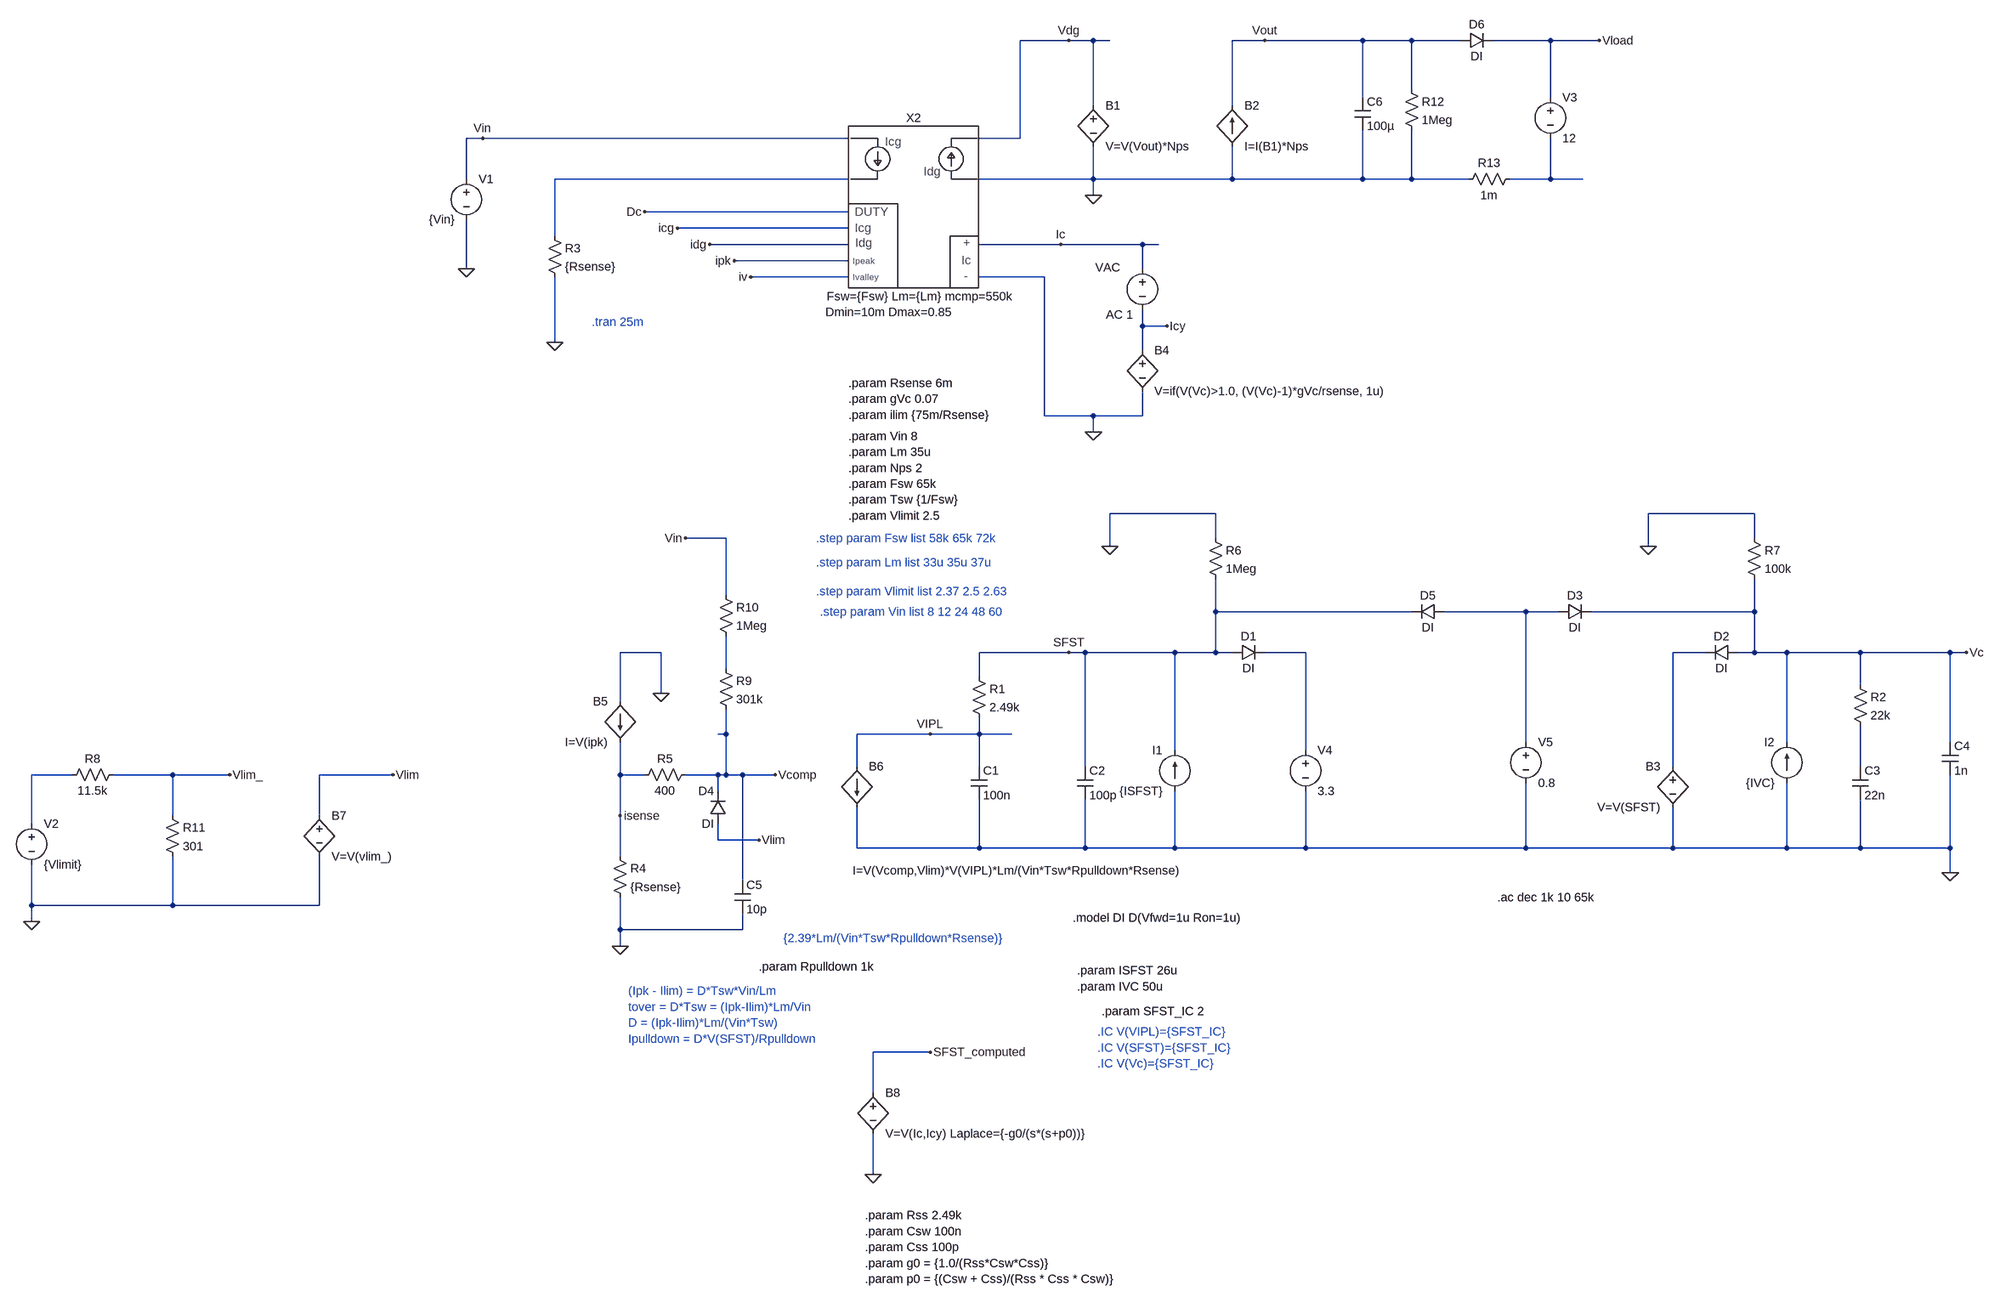
[diagram p0: schematic Intake_Power_Limiter_AC_Loop_Gain.asc]
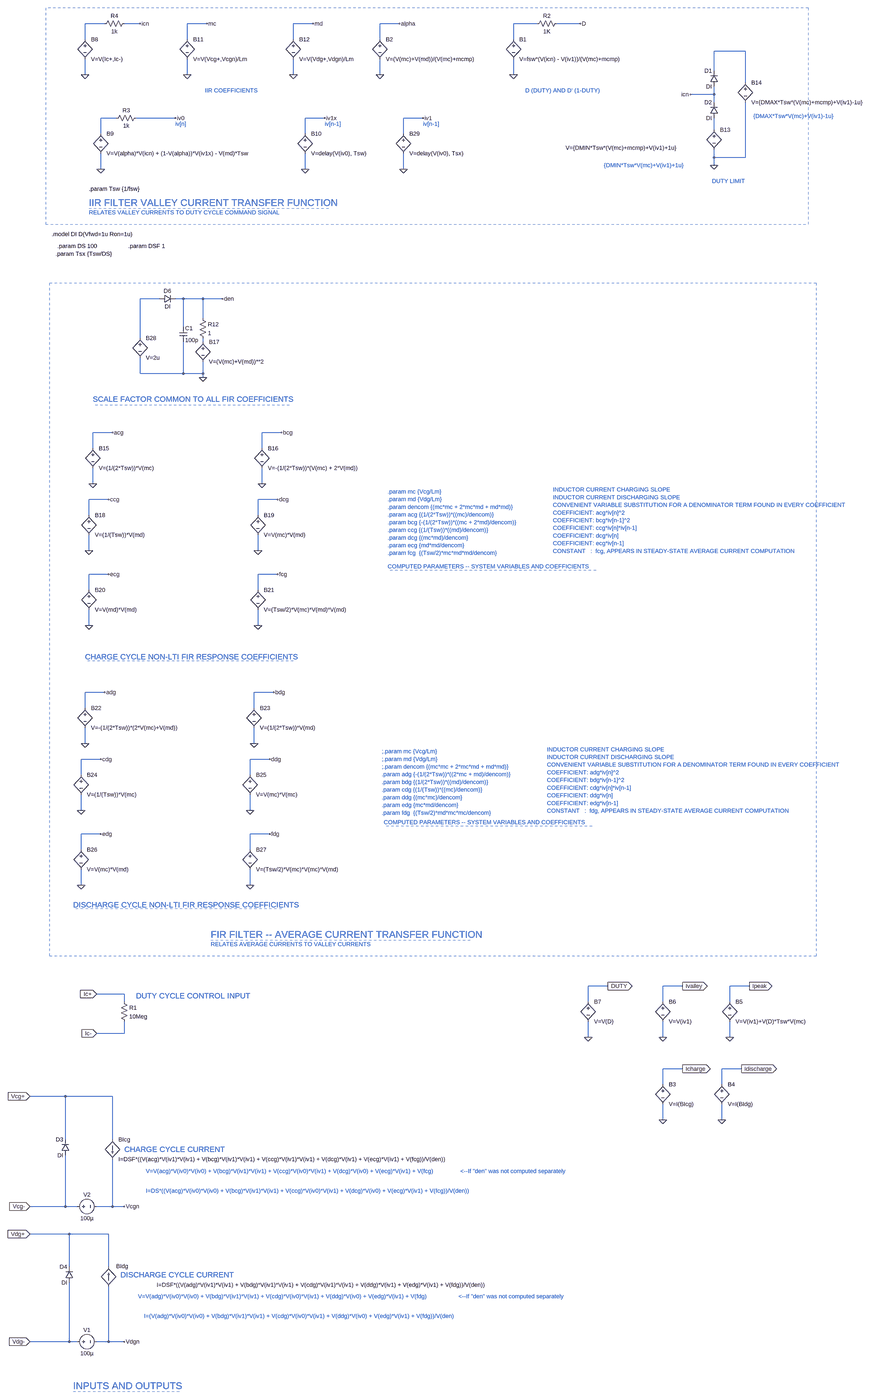
[diagram p1: sub-circuit cpm_control_irm.asc, whole sheet]
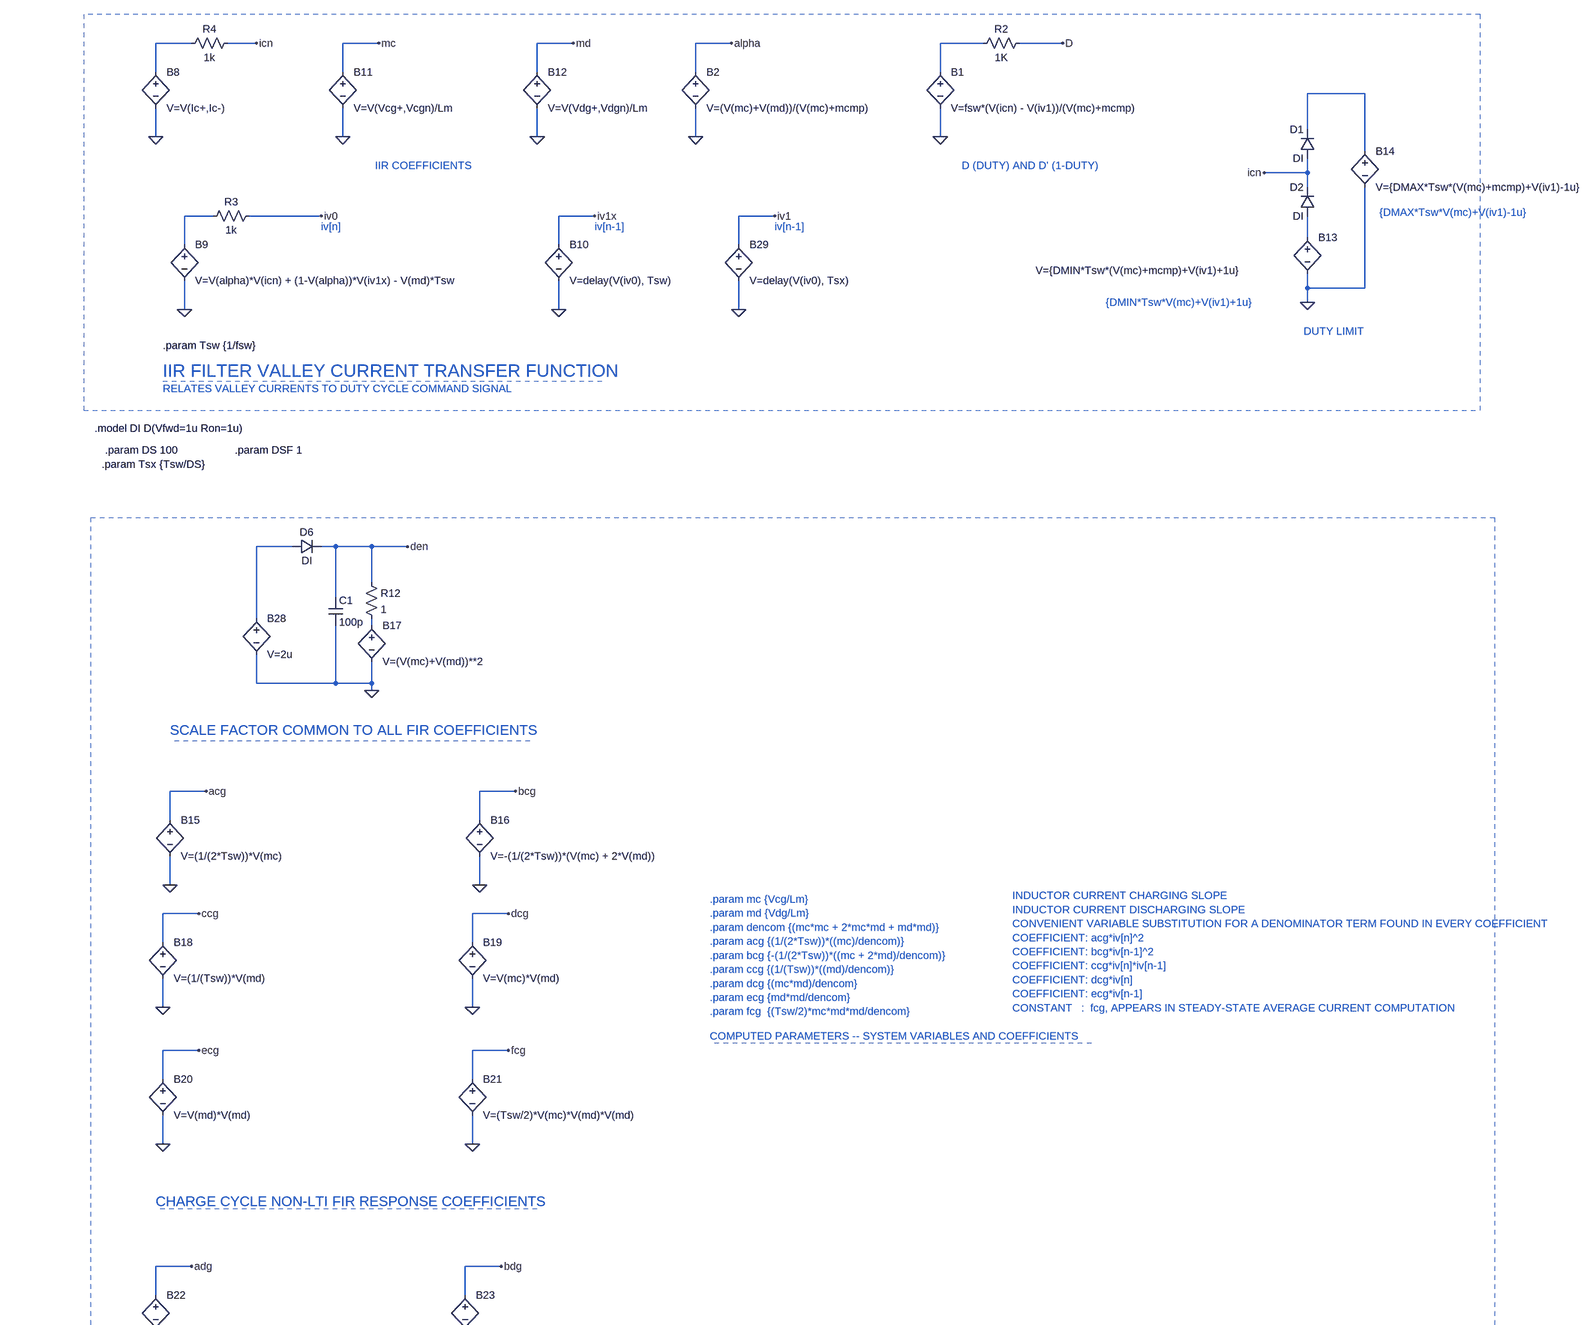
[diagram p2: sub-circuit cpm_control_irm.asc, part, row 1 of 2, column 1 of 1]
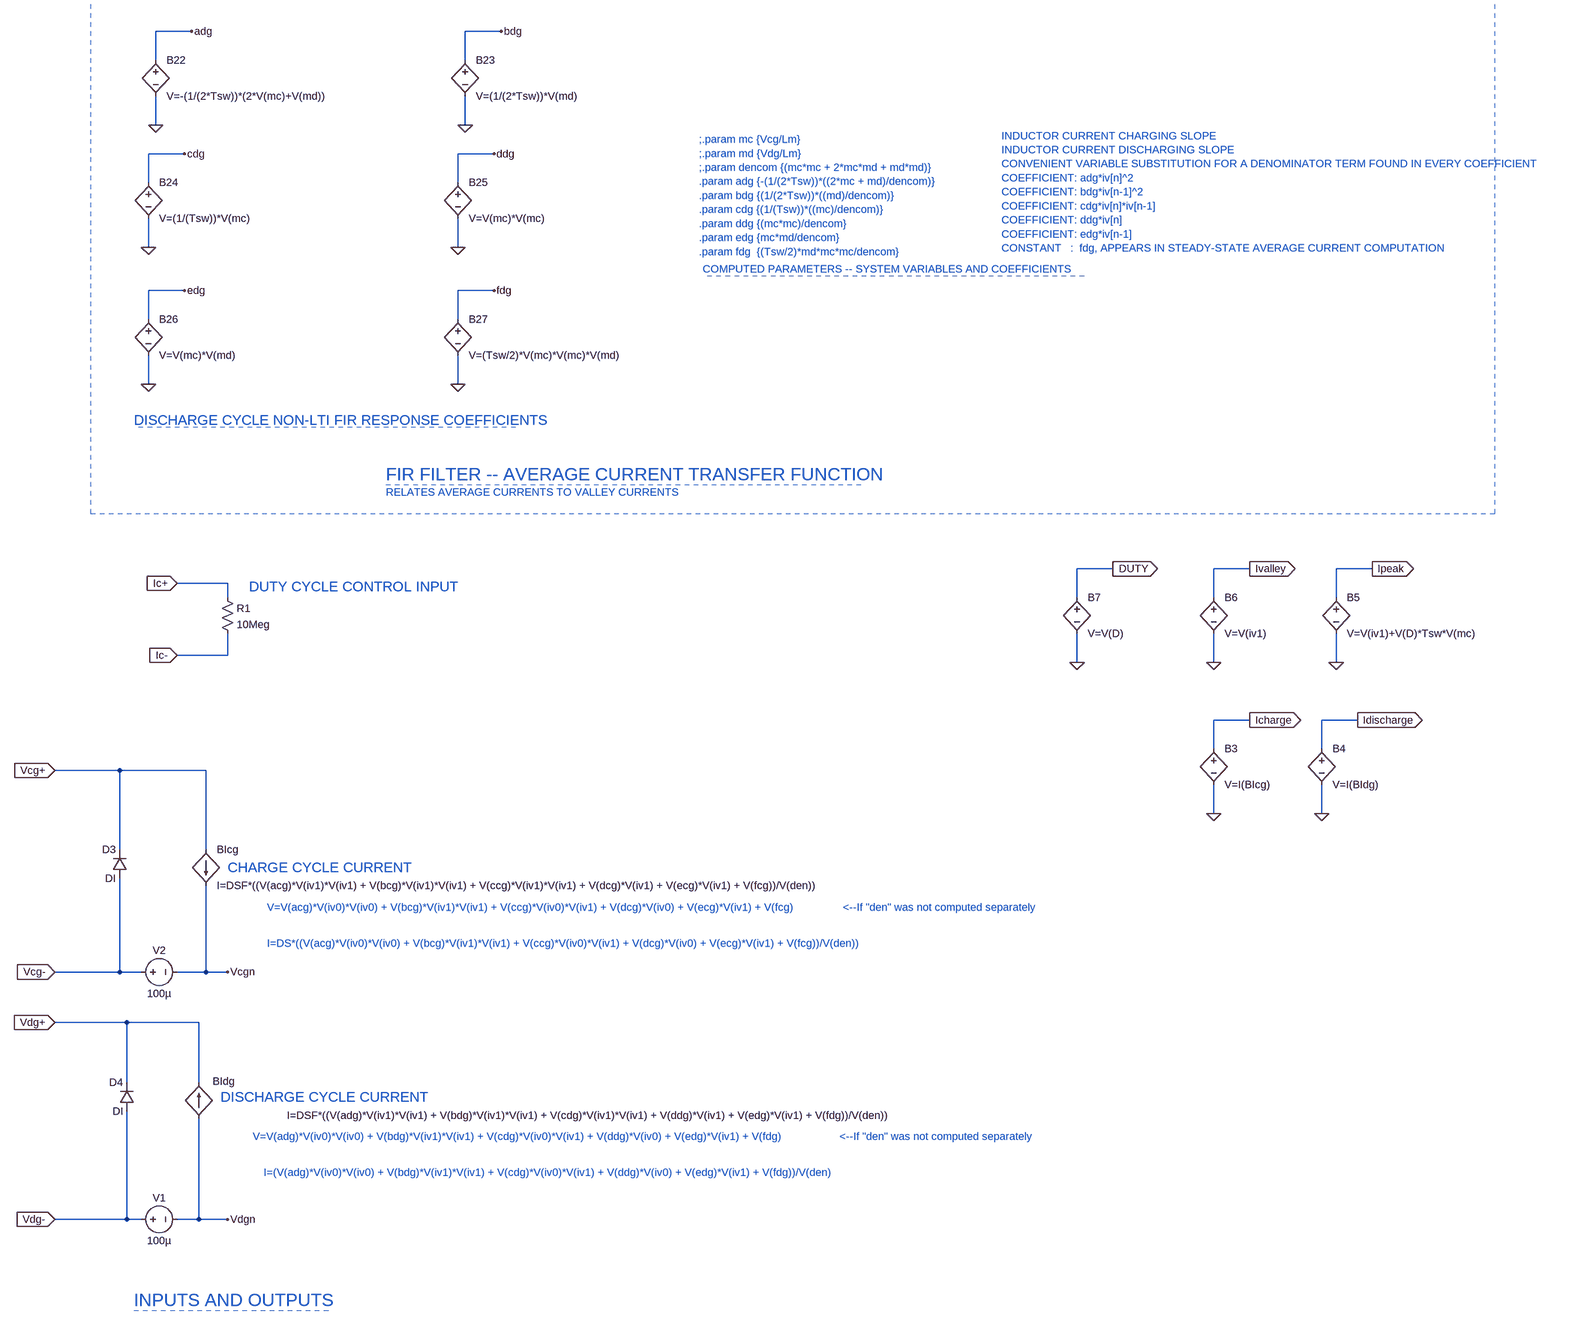
[diagram p3: sub-circuit cpm_control_irm.asc, part, row 2 of 2, column 1 of 1]
Intake_Power_Limiter_AC_Loop_Gain.asc, the LTspice schematic file:
Version 4
SHEET 1 2300 2304
WIRE 496 -128 400 -128
WIRE 544 -128 496 -128
WIRE 576 -128 544 -128
WIRE 880 -128 816 -128
WIRE 1072 -128 880 -128
WIRE 1168 -128 1072 -128
WIRE 1264 -128 1168 -128
WIRE 1440 -128 1328 -128
WIRE 1536 -128 1440 -128
WIRE 1168 -32 1168 -128
WIRE 1072 -16 1072 -128
WIRE 1440 -16 1440 -128
WIRE 544 0 544 -128
WIRE 816 0 816 -128
WIRE -912 64 -944 64
WIRE 64 64 -912 64
WIRE 400 64 400 -128
WIRE 400 64 320 64
WIRE -944 144 -944 64
WIRE 64 144 -512 144
WIRE 544 144 544 80
WIRE 544 144 320 144
WIRE 816 144 816 80
WIRE 816 144 544 144
WIRE 1072 144 1072 48
WIRE 1072 144 816 144
WIRE 1168 144 1168 48
WIRE 1168 144 1072 144
WIRE 1280 144 1168 144
WIRE 1440 144 1440 64
WIRE 1440 144 1360 144
WIRE 1504 144 1440 144
WIRE 544 176 544 144
WIRE 64 208 -336 208
WIRE 64 240 -272 240
WIRE -512 256 -512 144
WIRE 64 272 -208 272
WIRE 480 272 320 272
WIRE 640 272 480 272
WIRE 672 272 640 272
WIRE 64 304 -160 304
WIRE -944 320 -944 224
WIRE 640 320 640 272
WIRE 64 336 -128 336
WIRE 448 336 320 336
WIRE 640 432 640 400
WIRE 688 432 640 432
WIRE -512 464 -512 336
WIRE 640 480 640 432
WIRE 448 608 448 336
WIRE 544 608 448 608
WIRE 640 608 640 560
WIRE 640 608 544 608
WIRE 544 640 544 608
WIRE 784 800 576 800
WIRE 1840 800 1632 800
WIRE -176 848 -256 848
WIRE 784 848 784 800
WIRE 1840 848 1840 800
WIRE 576 864 576 800
WIRE 1632 864 1632 800
WIRE -176 960 -176 848
WIRE 784 992 784 928
WIRE 1168 992 784 992
WIRE 1392 992 1232 992
WIRE 1456 992 1392 992
WIRE 1840 992 1840 928
WIRE 1840 992 1520 992
WIRE -304 1072 -384 1072
WIRE 496 1072 320 1072
WIRE 528 1072 496 1072
WIRE 704 1072 528 1072
WIRE 784 1072 784 992
WIRE 784 1072 704 1072
WIRE 816 1072 784 1072
WIRE 960 1072 880 1072
WIRE 1744 1072 1680 1072
WIRE 1840 1072 1840 992
WIRE 1840 1072 1808 1072
WIRE 1904 1072 1840 1072
WIRE 2048 1072 1904 1072
WIRE 2224 1072 2048 1072
WIRE 2256 1072 2224 1072
WIRE -176 1104 -176 1040
WIRE 320 1120 320 1072
WIRE 2048 1136 2048 1072
WIRE -304 1152 -304 1072
WIRE -384 1168 -384 1072
WIRE -176 1232 -176 1184
WIRE -176 1232 -192 1232
WIRE 224 1232 80 1232
WIRE 320 1232 320 1200
WIRE 320 1232 224 1232
WIRE 384 1232 320 1232
WIRE 1392 1248 1392 992
WIRE 1904 1248 1904 1072
WIRE 2224 1248 2224 1072
WIRE 704 1264 704 1072
WIRE 960 1264 960 1072
WIRE 80 1296 80 1232
WIRE 320 1296 320 1232
WIRE 528 1296 528 1072
WIRE 1680 1296 1680 1072
WIRE 2048 1296 2048 1216
WIRE -1728 1312 -1808 1312
WIRE -1520 1312 -1648 1312
WIRE -1408 1312 -1520 1312
WIRE -1088 1312 -1232 1312
WIRE -384 1312 -384 1248
WIRE -336 1312 -384 1312
WIRE -192 1312 -256 1312
WIRE -176 1312 -176 1232
WIRE -176 1312 -192 1312
WIRE -144 1312 -176 1312
WIRE -80 1312 -144 1312
WIRE -192 1344 -192 1312
WIRE -1520 1392 -1520 1312
WIRE -1232 1392 -1232 1312
WIRE -384 1392 -384 1312
WIRE -1808 1408 -1808 1312
WIRE -192 1440 -192 1408
WIRE -112 1440 -192 1440
WIRE 80 1456 80 1376
WIRE 320 1456 320 1360
WIRE 320 1456 80 1456
WIRE 528 1456 528 1360
WIRE 528 1456 320 1456
WIRE 704 1456 704 1344
WIRE 704 1456 528 1456
WIRE 960 1456 960 1344
WIRE 960 1456 704 1456
WIRE 1392 1456 1392 1328
WIRE 1392 1456 960 1456
WIRE 1680 1456 1680 1376
WIRE 1680 1456 1392 1456
WIRE 1904 1456 1904 1328
WIRE 1904 1456 1680 1456
WIRE 2048 1456 2048 1360
WIRE 2048 1456 1904 1456
WIRE 2224 1456 2224 1312
WIRE 2224 1456 2048 1456
WIRE -384 1472 -384 1392
WIRE 2224 1504 2224 1456
WIRE -144 1520 -144 1312
WIRE -1808 1568 -1808 1488
WIRE -1520 1568 -1520 1472
WIRE -1520 1568 -1808 1568
WIRE -1232 1568 -1232 1472
WIRE -1232 1568 -1520 1568
WIRE -1808 1600 -1808 1568
WIRE -384 1616 -384 1552
WIRE -144 1616 -144 1584
WIRE -144 1616 -384 1616
WIRE -384 1648 -384 1616
WIRE 224 1856 112 1856
WIRE 112 1936 112 1856
WIRE 112 2096 112 2016
FLAG -944 320 0
FLAG 544 640 0
FLAG 1536 -128 Vload
FLAG -912 64 Vin
FLAG 480 272 Ic
FLAG -272 240 icg
FLAG -208 272 idg
FLAG -160 304 ipk
FLAG -128 336 iv
FLAG -336 208 Dc
FLAG -512 464 0
FLAG 496 -128 Vdg
FLAG 544 176 0
FLAG 2224 1504 0
FLAG 496 1072 SFST
FLAG 2256 1072 Vc
FLAG -384 1648 0
FLAG -304 1152 0
FLAG 576 864 0
FLAG 1632 864 0
FLAG -112 1440 Vlim
FLAG -256 848 Vin
FLAG -1808 1600 0
FLAG -1408 1312 Vlim_
FLAG 224 1232 VIPL
FLAG -80 1312 Vcomp
FLAG -384 1392 isense
FLAG -1088 1312 Vlim
FLAG 880 -128 Vout
FLAG 688 432 Icy
FLAG 112 2096 0
FLAG 224 1856 SFST_computed
DATAFLAG -208 240 ""
DATAFLAG -112 272 ""
DATAFLAG -112 304 ""
DATAFLAG -32 336 ""
DATAFLAG -208 208 ""
DATAFLAG 368 1072 ""
DATAFLAG -192 1232 ""
DATAFLAG -1184 1312 ""
DATAFLAG 2160 1072 ""
DATAFLAG 672 272 ""
DATAFLAG 384 1232 ""
DATAFLAG 576 -128 ""
DATAFLAG 1504 144 ""
SYMBOL voltage -944 128 R0
WINDOW 123 0 0 Left 0
WINDOW 39 0 0 Left 0
WINDOW 3 -73 95 Left 2
SYMATTR Value {Vin}
SYMATTR InstName V1
SYMBOL CPM_Control_IRM 192 144 R0
SYMATTR InstName X2
SYMATTR SpiceLine Fsw={Fsw} Lm={Lm} mcmp=550k
SYMATTR SpiceLine2 Dmin=10m Dmax=0.85
SYMBOL res -528 240 R0
SYMATTR InstName R3
SYMATTR Value {Rsense}
SYMBOL bv 544 -16 R0
SYMATTR InstName B1
SYMATTR Value V=V(Vout)*Nps
SYMBOL bi2 816 0 R0
SYMATTR InstName B2
SYMATTR Value I=I(B1)*Nps
SYMBOL voltage 1440 -32 R0
WINDOW 123 0 0 Left 0
WINDOW 39 0 0 Left 0
SYMATTR InstName V3
SYMATTR Value 12
SYMBOL cap 304 1296 R0
WINDOW 39 24 84 Left 2
SYMATTR InstName C1
SYMATTR Value 100n
SYMBOL cap 512 1296 R0
SYMATTR InstName C2
SYMATTR Value 100p
SYMATTR SpiceLine Rser=5m
SYMBOL res 304 1104 R0
SYMATTR InstName R1
SYMATTR Value 2.49k
SYMBOL current 704 1344 R180
WINDOW 0 24 80 Left 2
WINDOW 3 24 0 Left 2
WINDOW 123 0 0 Left 0
WINDOW 39 0 0 Left 0
SYMATTR InstName I1
SYMATTR Value {ISFST}
SYMBOL diode 816 1088 R270
WINDOW 0 32 32 VTop 2
WINDOW 3 0 32 VBottom 2
SYMATTR InstName D1
SYMATTR Value DI
SYMBOL voltage 960 1248 R0
WINDOW 123 0 0 Left 0
WINDOW 39 0 0 Left 0
SYMATTR InstName V4
SYMATTR Value 3.3
SYMBOL cap 2032 1296 R0
SYMATTR InstName C3
SYMATTR Value 22n
SYMBOL cap 2208 1248 R0
SYMATTR InstName C4
SYMATTR Value 1n
SYMBOL res 2032 1120 R0
SYMATTR InstName R2
SYMATTR Value 22k
SYMBOL current 1904 1328 R180
WINDOW 0 24 80 Left 2
WINDOW 3 24 0 Left 2
WINDOW 123 0 0 Left 0
WINDOW 39 0 0 Left 0
SYMATTR InstName I2
SYMATTR Value {IVC}
SYMBOL bv 1680 1280 M0
SYMATTR InstName B3
SYMATTR Value V=V(SFST)
SYMBOL diode 1808 1056 R90
WINDOW 0 0 32 VBottom 2
WINDOW 3 32 32 VTop 2
SYMATTR InstName D2
SYMATTR Value DI
SYMBOL diode 1456 1008 R270
WINDOW 0 32 32 VTop 2
WINDOW 3 0 32 VBottom 2
SYMATTR InstName D3
SYMATTR Value DI
SYMBOL voltage 1392 1232 R0
WINDOW 123 0 0 Left 0
WINDOW 39 0 0 Left 0
SYMATTR InstName V5
SYMATTR Value 0.8
SYMBOL bv 640 464 R0
SYMATTR InstName B4
SYMATTR Value V=if(V(Vc)>1.0, (V(Vc)-1)*gVc/rsense, 1u)
SYMBOL res -400 1456 R0
SYMATTR InstName R4
SYMATTR Value {Rsense}
SYMBOL bi -384 1168 M0
SYMATTR InstName B5
SYMATTR Value I=V(ipk)
SYMBOL res -240 1296 R90
WINDOW 0 0 56 VBottom 2
WINDOW 3 32 56 VTop 2
SYMATTR InstName R5
SYMATTR Value 400
SYMBOL diode -176 1408 R180
WINDOW 0 24 64 Left 2
WINDOW 3 24 0 Left 2
SYMATTR InstName D4
SYMATTR Value DI
SYMBOL diode 1232 976 R90
WINDOW 0 0 32 VBottom 2
WINDOW 3 32 32 VTop 2
SYMATTR InstName D5
SYMATTR Value DI
SYMBOL res 768 832 R0
SYMATTR InstName R6
SYMATTR Value 1Meg
SYMBOL res 1824 832 R0
SYMATTR InstName R7
SYMATTR Value 100k
SYMBOL res -192 1088 R0
SYMATTR InstName R9
SYMATTR Value 301k
SYMBOL res -192 944 R0
SYMATTR InstName R10
SYMATTR Value 1Meg
SYMBOL voltage -1808 1392 R0
WINDOW 123 0 0 Left 0
WINDOW 39 0 0 Left 0
SYMATTR InstName V2
SYMATTR Value {Vlimit}
SYMBOL cap -160 1520 R0
SYMATTR InstName C5
SYMATTR Value 10p
SYMATTR SpiceLine Rser=10
SYMBOL res -1632 1296 R90
WINDOW 0 0 56 VBottom 2
WINDOW 3 32 56 VTop 2
SYMATTR InstName R8
SYMATTR Value 11.5k
SYMBOL res -1536 1376 R0
SYMATTR InstName R11
SYMATTR Value 301
SYMBOL bv -1232 1376 R0
SYMATTR InstName B7
SYMATTR Value V=V(vlim_)
SYMBOL diode 1264 -112 R270
WINDOW 0 32 32 VTop 2
WINDOW 3 0 32 VBottom 2
SYMATTR InstName D6
SYMATTR Value DI
SYMBOL res 1152 -48 R0
SYMATTR InstName R12
SYMATTR Value 1Meg
SYMBOL cap 1056 -16 R0
SYMATTR InstName C6
SYMATTR Value 100µ
SYMATTR SpiceLine Rser=1
SYMBOL voltage 640 304 R0
WINDOW 0 -92 13 Left 2
WINDOW 123 -71 106 Left 2
WINDOW 39 0 0 Left 0
SYMATTR InstName VAC
SYMATTR Value ""
SYMATTR Value2 AC 1
SYMBOL res 1376 128 R90
WINDOW 0 0 56 VBottom 2
WINDOW 3 32 56 VTop 2
SYMATTR InstName R13
SYMATTR Value 1m
SYMBOL bv 112 1920 R0
SYMATTR InstName B8
SYMATTR Value V=V(Ic,Icy) Laplace={-g0/(s*(s+p0))}
SYMBOL bi 80 1296 R0
WINDOW 3 -8 204 Left 2
SYMATTR InstName B6
SYMATTR Value I=V(Vcomp,Vlim)*V(VIPL)*Lm/(Vin*Tsw*Rpulldown*Rsense)
TEXT -440 424 Left 2 ;.tran 25m
TEXT 64 544 Left 2 !.param Rsense 6m\n.param gVc 0.07\n.param ilim {75m/Rsense}
TEXT 64 648 Left 2 !.param Vin 8\n.param Lm 35u\n.param Nps 2\n.param Fsw 65k\n.param Tsw {1/Fsw}\n.param Vlimit 2.5
TEXT 504 1592 Left 2 !.model DI D(Vfwd=1u Ron=1u)
TEXT -112 1688 Left 2 !.param Rpulldown 1k
TEXT -368 1736 Left 2 ;(Ipk - Ilim) = D*Tsw*Vin/Lm\ntover = D*Tsw = (Ipk-Ilim)*Lm/Vin\nD = (Ipk-Ilim)*Lm/(Vin*Tsw)\nIpulldown = D*V(SFST)/Rpulldown
TEXT 512 1696 Left 2 !.param ISFST 26u\n.param IVC 50u
TEXT 0 848 Left 2 ;.step param Fsw list 58k 65k 72k
TEXT 0 896 Left 2 ;.step param Lm list 33u 35u 37u
TEXT 0 952 Left 2 ;.step param Vlimit list 2.37 2.5 2.63
TEXT 552 1816 Left 2 ;.IC V(VIPL)={SFST_IC}\n.IC V(SFST)={SFST_IC}\n.IC V(Vc)={SFST_IC}
TEXT 560 1776 Left 2 !.param SFST_IC 2
TEXT 1336 1552 Left 2 !.ac dec 1k 10 65k
TEXT 8 992 Left 2 ;.step param Vin list 8 12 24 48 60
TEXT 96 2176 Left 2 !.param Rss 2.49k\n.param Csw 100n\n.param Css 100p\n.param g0 = {1.0/(Rss*Csw*Css)}\n.param p0 = {(Csw + Css)/(Rss * Css * Csw)}
TEXT -64 1632 Left 2 ;{2.39*Lm/(Vin*Tsw*Rpulldown*Rsense)}

cpm_control_irm.asc, the sub-circuit schematic file:
Version 4
SHEET 1 4228 8404
WIRE -976 1360 -1056 1360
WIRE -832 1360 -896 1360
WIRE -560 1360 -640 1360
WIRE -128 1360 -208 1360
WIRE 224 1360 144 1360
WIRE 784 1360 688 1360
WIRE 960 1360 864 1360
WIRE -1056 1424 -1056 1360
WIRE -640 1424 -640 1360
WIRE -208 1424 -208 1360
WIRE 144 1424 144 1360
WIRE 688 1424 688 1360
WIRE 1632 1472 1504 1472
WIRE 1504 1552 1504 1472
WIRE -1056 1568 -1056 1504
WIRE -640 1568 -640 1504
WIRE -208 1568 -208 1504
WIRE 144 1568 144 1504
WIRE 688 1568 688 1504
WIRE 1632 1600 1632 1472
WIRE 1504 1648 1504 1616
WIRE 1504 1648 1408 1648
WIRE 1504 1680 1504 1648
WIRE -928 1744 -992 1744
WIRE -688 1744 -848 1744
WIRE -80 1744 -160 1744
WIRE 320 1744 240 1744
WIRE 1504 1792 1504 1744
WIRE -992 1808 -992 1744
WIRE -160 1808 -160 1744
WIRE 240 1808 240 1744
WIRE 1504 1904 1504 1872
WIRE 1632 1904 1632 1680
WIRE 1632 1904 1504 1904
WIRE 1504 1936 1504 1904
WIRE -992 1952 -992 1888
WIRE -160 1952 -160 1888
WIRE 240 1952 240 1888
WIRE -752 3792 -832 3792
WIRE -656 3792 -688 3792
WIRE -576 3792 -656 3792
WIRE -496 3792 -576 3792
WIRE -576 3872 -576 3792
WIRE -656 3904 -656 3792
WIRE -832 3952 -832 3792
WIRE -576 3968 -576 3952
WIRE -832 4096 -832 4032
WIRE -656 4096 -656 3968
WIRE -656 4096 -832 4096
WIRE -576 4096 -576 4048
WIRE -576 4096 -656 4096
WIRE -576 4112 -576 4096
WIRE -944 4336 -1024 4336
WIRE -256 4336 -336 4336
WIRE -1024 4400 -1024 4336
WIRE -336 4400 -336 4336
WIRE -1024 4544 -1024 4480
WIRE -336 4544 -336 4480
WIRE -960 4608 -1040 4608
WIRE -272 4608 -352 4608
WIRE -1040 4672 -1040 4608
WIRE -352 4672 -352 4608
WIRE -1040 4816 -1040 4752
WIRE -352 4816 -352 4752
WIRE -960 4912 -1040 4912
WIRE -272 4912 -352 4912
WIRE -1040 4976 -1040 4912
WIRE -352 4976 -352 4912
WIRE -1040 5120 -1040 5056
WIRE -352 5120 -352 5056
WIRE -976 5392 -1056 5392
WIRE -288 5392 -368 5392
WIRE -1056 5456 -1056 5392
WIRE -368 5456 -368 5392
WIRE -1056 5600 -1056 5536
WIRE -368 5600 -368 5536
WIRE -992 5664 -1072 5664
WIRE -304 5664 -384 5664
WIRE -1072 5728 -1072 5664
WIRE -384 5728 -384 5664
WIRE -1072 5872 -1072 5808
WIRE -384 5872 -384 5808
WIRE -992 5968 -1072 5968
WIRE -304 5968 -384 5968
WIRE -1072 6032 -1072 5968
WIRE -384 6032 -384 5968
WIRE -1072 6176 -1072 6112
WIRE -384 6176 -384 6112
WIRE 1072 6608 992 6608
WIRE 1376 6608 1296 6608
WIRE 1648 6608 1568 6608
WIRE -896 6640 -1008 6640
WIRE -896 6672 -896 6640
WIRE 992 6672 992 6608
WIRE 1296 6672 1296 6608
WIRE 1568 6672 1568 6608
WIRE -896 6800 -896 6752
WIRE -896 6800 -1008 6800
WIRE 992 6816 992 6752
WIRE 1296 6816 1296 6752
WIRE 1568 6816 1568 6752
WIRE 1376 6944 1296 6944
WIRE 1616 6944 1536 6944
WIRE 1296 7008 1296 6944
WIRE 1536 7008 1536 6944
WIRE -1136 7056 -1280 7056
WIRE -944 7056 -1136 7056
WIRE 1296 7152 1296 7088
WIRE 1536 7152 1536 7088
WIRE -1136 7232 -1136 7056
WIRE -944 7232 -944 7056
WIRE -1136 7504 -1136 7296
WIRE -1136 7504 -1280 7504
WIRE -1088 7504 -1136 7504
WIRE -944 7504 -944 7312
WIRE -944 7504 -1008 7504
WIRE -896 7504 -944 7504
WIRE -1120 7616 -1280 7616
WIRE -960 7616 -1120 7616
WIRE -1120 7888 -1120 7616
WIRE -960 7888 -960 7616
WIRE -1120 8192 -1120 7952
WIRE -1120 8192 -1280 8192
WIRE -1088 8192 -1120 8192
WIRE -960 8192 -960 7968
WIRE -960 8192 -1008 8192
WIRE -896 8192 -960 8192
FLAG -992 1952 0
FLAG -688 1744 iv0
FLAG -160 1952 0
FLAG -80 1744 iv1x
FLAG -640 1568 0
FLAG -560 1360 mc
FLAG -208 1568 0
FLAG -128 1360 md
FLAG -1024 4544 0
FLAG -944 4336 acg
FLAG -336 4544 0
FLAG -256 4336 bcg
FLAG -576 4112 0
FLAG -496 3792 den
FLAG -1040 4816 0
FLAG -960 4608 ccg
FLAG -352 4816 0
FLAG -272 4608 dcg
FLAG -1040 5120 0
FLAG -960 4912 ecg
FLAG -352 5120 0
FLAG -272 4912 fcg
FLAG -1056 5600 0
FLAG -976 5392 adg
FLAG -368 5600 0
FLAG -288 5392 bdg
FLAG -1072 5872 0
FLAG -992 5664 cdg
FLAG -384 5872 0
FLAG -304 5664 ddg
FLAG -1072 6176 0
FLAG -992 5968 edg
FLAG -384 6176 0
FLAG -304 5968 fdg
FLAG -1280 7056 Vcg+
IOPIN -1280 7056 In
FLAG -1280 7504 Vcg-
IOPIN -1280 7504 In
FLAG -1280 7616 Vdg+
IOPIN -1280 7616 In
FLAG -1280 8192 Vdg-
IOPIN -1280 8192 In
FLAG -1008 6640 Ic+
IOPIN -1008 6640 In
FLAG -1008 6800 Ic-
IOPIN -1008 6800 In
FLAG 688 1568 0
FLAG 960 1360 D
FLAG 1504 1936 0
FLAG 1296 7152 0
FLAG 1376 6944 Icharge
IOPIN 1376 6944 Out
FLAG 1536 7152 0
FLAG 1616 6944 Idischarge
IOPIN 1616 6944 Out
FLAG 1568 6816 0
FLAG 1648 6608 Ipeak
IOPIN 1648 6608 Out
FLAG 1296 6816 0
FLAG 1376 6608 Ivalley
IOPIN 1376 6608 Out
FLAG 992 6816 0
FLAG 1072 6608 DUTY
IOPIN 1072 6608 Out
FLAG 144 1568 0
FLAG 224 1360 alpha
FLAG -1056 1568 0
FLAG -832 1360 icn
FLAG -896 7504 Vcgn
FLAG -896 8192 Vdgn
FLAG 1408 1648 icn
FLAG 240 1952 0
FLAG 320 1744 iv1
SYMBOL bv -992 1792 R0
SYMATTR InstName B9
SYMATTR Value V=V(alpha)*V(icn) + (1-V(alpha))*V(iv1x) - V(md)*Tsw
SYMBOL bv -160 1792 R0
SYMATTR InstName B10
SYMATTR Value V=delay(V(iv0), Tsw)
SYMBOL bv -640 1408 R0
SYMATTR InstName B11
SYMATTR Value V=V(Vcg+,Vcgn)/Lm
SYMBOL bv -208 1408 R0
SYMATTR InstName B12
SYMATTR Value V=V(Vdg+,Vdgn)/Lm
SYMBOL bv -1024 4384 R0
SYMATTR InstName B15
SYMATTR Value V=(1/(2*Tsw))*V(mc)
SYMBOL bv -336 4384 R0
SYMATTR InstName B16
SYMATTR Value V=-(1/(2*Tsw))*(V(mc) + 2*V(md))
SYMBOL bv -576 3952 R0
SYMATTR InstName B17
SYMATTR Value V=(V(mc)+V(md))**2
SYMBOL bv -1040 4656 R0
SYMATTR InstName B18
SYMATTR Value V=(1/(Tsw))*V(md)
SYMBOL bv -352 4656 R0
SYMATTR InstName B19
SYMATTR Value V=V(mc)*V(md)
SYMBOL bv -1040 4960 R0
SYMATTR InstName B20
SYMATTR Value V=V(md)*V(md)
SYMBOL bv -352 4960 R0
SYMATTR InstName B21
SYMATTR Value V=(Tsw/2)*V(mc)*V(md)*V(md)
SYMBOL bv -1056 5440 R0
SYMATTR InstName B22
SYMATTR Value V=-(1/(2*Tsw))*(2*V(mc)+V(md))
SYMBOL bv -368 5440 R0
SYMATTR InstName B23
SYMATTR Value V=(1/(2*Tsw))*V(md)
SYMBOL bv -1072 5712 R0
SYMATTR InstName B24
SYMATTR Value V=(1/(Tsw))*V(mc)
SYMBOL bv -384 5712 R0
SYMATTR InstName B25
SYMATTR Value V=V(mc)*V(mc)
SYMBOL bv -1072 6016 R0
SYMATTR InstName B26
SYMATTR Value V=V(mc)*V(md)
SYMBOL bv -384 6016 R0
SYMATTR InstName B27
SYMATTR Value V=(Tsw/2)*V(mc)*V(mc)*V(md)
SYMBOL bi -960 7968 R180
WINDOW 0 -80 83 Left 2
WINDOW 3 -1529 7 Left 2
SYMATTR InstName BIdg
SYMATTR Value I=DSF*((V(adg)*V(iv1)*V(iv1) + V(bdg)*V(iv1)*V(iv1) + V(cdg)*V(iv1)*V(iv1) + V(ddg)*V(iv1) + V(edg)*V(iv1) + V(fdg))/V(den))
SYMBOL bi -944 7232 R0
SYMATTR InstName BIcg
SYMATTR Value I=DSF*((V(acg)*V(iv1)*V(iv1) + V(bcg)*V(iv1)*V(iv1) + V(ccg)*V(iv1)*V(iv1) + V(dcg)*V(iv1) + V(ecg)*V(iv1) + V(fcg))/V(den))
SYMBOL res -592 3856 R0
SYMATTR InstName R12
SYMATTR Value 1
SYMBOL diode -752 3808 R270
WINDOW 0 32 32 VTop 2
WINDOW 3 0 32 VBottom 2
SYMATTR InstName D6
SYMATTR Value DI
SYMBOL bv -832 3936 R0
SYMATTR InstName B28
SYMATTR Value V=2u
SYMBOL cap -672 3904 R0
SYMATTR InstName C1
SYMATTR Value 100p
SYMBOL res -912 6656 R0
SYMATTR InstName R1
SYMATTR Value 10Meg
SYMBOL bv 688 1408 R0
SYMATTR InstName B1
SYMATTR Value V=fsw*(V(icn) - V(iv1))/(V(mc)+mcmp)
SYMBOL res 880 1344 R90
WINDOW 0 0 56 VBottom 2
WINDOW 3 32 56 VTop 2
SYMATTR InstName R2
SYMATTR Value 1K
SYMBOL diode 1520 1616 R180
WINDOW 0 24 64 Left 2
WINDOW 3 24 0 Left 2
SYMATTR InstName D1
SYMATTR Value DI
SYMBOL diode 1520 1744 R180
WINDOW 0 24 64 Left 2
WINDOW 3 24 0 Left 2
SYMATTR InstName D2
SYMATTR Value DI
SYMBOL bv 1296 6992 R0
SYMATTR InstName B3
SYMATTR Value V=I(BIcg)
SYMBOL bv 1536 6992 R0
SYMATTR InstName B4
SYMATTR Value V=I(BIdg)
SYMBOL bv 1568 6656 R0
SYMATTR InstName B5
SYMATTR Value V=V(iv1)+V(D)*Tsw*V(mc)
SYMBOL bv 1296 6656 R0
SYMATTR InstName B6
SYMATTR Value V=V(iv1)
SYMBOL bv 992 6656 R0
SYMATTR InstName B7
SYMATTR Value V=V(D)
SYMBOL res -832 1728 R90
WINDOW 0 0 56 VBottom 2
WINDOW 3 32 56 VTop 2
SYMATTR InstName R3
SYMATTR Value 1k
SYMBOL bv 144 1408 R0
SYMATTR InstName B2
SYMATTR Value V=(V(mc)+V(md))/(V(mc)+mcmp)
SYMBOL bv -1056 1408 R0
SYMATTR InstName B8
SYMATTR Value V=V(Ic+,Ic-)
SYMBOL bv 1504 1776 R0
WINDOW 3 -604 89 Left 2
SYMATTR Value V={DMIN*Tsw*(V(mc)+mcmp)+V(iv1)+1u}
SYMATTR InstName B13
SYMBOL bv 1632 1584 R0
SYMATTR InstName B14
SYMATTR Value V={DMAX*Tsw*(V(mc)+mcmp)+V(iv1)-1u}
SYMBOL diode -1120 7296 R180
WINDOW 0 24 64 Left 2
WINDOW 3 24 0 Left 2
SYMATTR InstName D3
SYMATTR Value DI
SYMBOL diode -1104 7952 R180
WINDOW 0 24 64 Left 2
WINDOW 3 24 0 Left 2
SYMATTR InstName D4
SYMATTR Value DI
SYMBOL voltage -1104 8192 R270
WINDOW 0 32 56 VTop 2
WINDOW 3 -32 56 VBottom 2
WINDOW 123 0 0 Left 0
WINDOW 39 0 0 Left 0
SYMATTR InstName V1
SYMATTR Value 100µ
SYMBOL voltage -1104 7504 R270
WINDOW 0 32 56 VTop 2
WINDOW 3 -32 56 VBottom 2
WINDOW 123 0 0 Left 0
WINDOW 39 0 0 Left 0
SYMATTR InstName V2
SYMATTR Value 100µ
SYMBOL res -880 1344 R90
WINDOW 0 0 56 VBottom 2
WINDOW 3 32 56 VTop 2
SYMATTR InstName R4
SYMATTR Value 1k
SYMBOL bv 240 1792 R0
SYMATTR InstName B29
SYMATTR Value V=delay(V(iv0), Tsx)
TEXT -688 1768 Left 2 ;iv[n]
TEXT -1040 2088 Left 4 ;IIR FILTER VALLEY CURRENT TRANSFER FUNCTION
TEXT -1040 2128 Left 2 ;RELATES VALLEY CURRENTS TO DUTY CYCLE COMMAND SIGNAL
TEXT -80 1768 Left 2 ;iv[n-1]
TEXT 176 4576 Left 2 ;.param mc {Vcg/Lm}\n.param md {Vdg/Lm}\n.param dencom {(mc*mc + 2*mc*md + md*md)}\n.param acg {(1/(2*Tsw))*((mc)/dencom)}\n.param bcg {-(1/(2*Tsw))*((mc + 2*md)/dencom)}\n.param ccg {(1/(Tsw))*((md)/dencom)}\n.param dcg {(mc*md)/dencom}\n.param ecg {md*md/dencom}\n.param fcg  {(Tsw/2)*mc*md*md/dencom}
TEXT 848 4568 Left 2 ;INDUCTOR CURRENT CHARGING SLOPE\nINDUCTOR CURRENT DISCHARGING SLOPE\nCONVENIENT VARIABLE SUBSTITUTION FOR A DENOMINATOR TERM FOUND IN EVERY COEFFICIENT\nCOEFFICIENT: acg*iv[n]^2\nCOEFFICIENT: bcg*iv[n-1]^2\nCOEFFICIENT: ccg*iv[n]*iv[n-1]\nCOEFFICIENT: dcg*iv[n]\nCOEFFICIENT: ecg*iv[n-1]\nCONSTANT   :  fcg, APPEARS IN STEADY-STATE AVERAGE CURRENT COMPUTATION
TEXT 176 4880 Left 2 ;COMPUTED PARAMETERS -- SYSTEM VARIABLES AND COEFFICIENTS
TEXT 152 5632 Left 2 ;;.param mc {Vcg/Lm}\n;.param md {Vdg/Lm}\n;.param dencom {(mc*mc + 2*mc*md + md*md)}\n.param adg {-(1/(2*Tsw))*((2*mc + md)/dencom)}\n.param bdg {(1/(2*Tsw))*((md)/dencom)}\n.param cdg {(1/(Tsw))*((mc)/dencom)}\n.param ddg {(mc*mc)/dencom}\n.param edg {mc*md/dencom}\n.param fdg  {(Tsw/2)*md*mc*mc/dencom}
TEXT 824 5624 Left 2 ;INDUCTOR CURRENT CHARGING SLOPE\nINDUCTOR CURRENT DISCHARGING SLOPE\nCONVENIENT VARIABLE SUBSTITUTION FOR A DENOMINATOR TERM FOUND IN EVERY COEFFICIENT\nCOEFFICIENT: adg*iv[n]^2\nCOEFFICIENT: bdg*iv[n-1]^2\nCOEFFICIENT: cdg*iv[n]*iv[n-1]\nCOEFFICIENT: ddg*iv[n]\nCOEFFICIENT: edg*iv[n-1]\nCONSTANT   :  fdg, APPEARS IN STEADY-STATE AVERAGE CURRENT COMPUTATION
TEXT -808 7360 Left 2 ;V=V(acg)*V(iv0)*V(iv0) + V(bcg)*V(iv1)*V(iv1) + V(ccg)*V(iv0)*V(iv1) + V(dcg)*V(iv0) + V(ecg)*V(iv1) + V(fcg)
TEXT -840 8008 Left 2 ;V=V(adg)*V(iv0)*V(iv0) + V(bdg)*V(iv1)*V(iv1) + V(cdg)*V(iv0)*V(iv1) + V(ddg)*V(iv0) + V(edg)*V(iv1) + V(fdg)
TEXT -1056 5248 Left 3 ;CHARGE CYCLE NON-LTI FIR RESPONSE COEFFICIENTS
TEXT -1104 6256 Left 3 ;DISCHARGE CYCLE NON-LTI FIR RESPONSE COEFFICIENTS
TEXT 160 5920 Left 2 ;COMPUTED PARAMETERS -- SYSTEM VARIABLES AND COEFFICIENTS
TEXT -1024 4200 Left 3 ;SCALE FACTOR COMMON TO ALL FIR COEFFICIENTS
TEXT -544 6376 Left 4 ;FIR FILTER -- AVERAGE CURRENT TRANSFER FUNCTION
TEXT -544 6416 Left 2 ;RELATES AVERAGE CURRENTS TO VALLEY CURRENTS
TEXT 472 7360 Left 2 ;<--If "den" was not computed separately
TEXT 464 8008 Left 2 ;<--If "den" was not computed separately
TEXT -1104 8376 Left 4 ;INPUTS AND OUTPUTS
TEXT -912 7920 Left 3 ;DISCHARGE CYCLE CURRENT
TEXT -896 7272 Left 3 ;CHARGE CYCLE CURRENT
TEXT -848 6648 Left 3 ;DUTY CYCLE CONTROL INPUT
TEXT -1192 2216 Left 2 !.model DI D(Vfwd=1u Ron=1u)
TEXT 1496 2000 Left 2 ;DUTY LIMIT
TEXT 736 1632 Left 2 ;D (DUTY) AND D' (1-DUTY)
TEXT -568 1632 Left 2 ;IIR COEFFICIENTS
TEXT -1040 2032 Left 2 !.param Tsw {1/fsw}
TEXT 1056 1936 Left 2 ;{DMIN*Tsw*V(mc)+V(iv1)+1u}
TEXT 1664 1736 Left 2 ;{DMAX*Tsw*V(mc)+V(iv1)-1u}
TEXT -816 8088 Left 2 ;I=(V(adg)*V(iv0)*V(iv0) + V(bdg)*V(iv1)*V(iv1) + V(cdg)*V(iv0)*V(iv1) + V(ddg)*V(iv0) + V(edg)*V(iv1) + V(fdg))/V(den)
TEXT -1176 2296 Left 2 !.param Tsx {Tsw/DS}
TEXT -1168 2264 Left 2 !.param DS 100
TEXT -808 7440 Left 2 ;I=DS*((V(acg)*V(iv0)*V(iv0) + V(bcg)*V(iv1)*V(iv1) + V(ccg)*V(iv0)*V(iv1) + V(dcg)*V(iv0) + V(ecg)*V(iv1) + V(fcg))/V(den))
TEXT 320 1768 Left 2 ;iv[n-1]
TEXT -880 2264 Left 2 !.param DSF 1
LINE Normal -64 2112 -1040 2112 2
LINE Normal 1024 4896 176 4896 2
LINE Normal -208 5264 -1056 5264 2
LINE Normal -256 6272 -1104 6272 2
LINE Normal 1008 5936 160 5936 2
LINE Normal -224 4224 -1024 4224 2
LINE Normal 512 6400 -544 6400 2
LINE Normal -672 8400 -1104 8400 2
RECTANGLE Normal 1920 6464 -1200 3728 2
RECTANGLE Normal 1888 1296 -1216 2176 2

The netlist it stands for:
* Intake_Power_Limiter_AC_Loop_Gain.asc
V1 Vin 0 {Vin}
XX2 Ic 0 Vin N001 Vdg 0 icg idg ipk iv Dc cpm_control_irm params: Fsw={Fsw} Lm={Lm} mcmp=550k Dmin=10m Dmax=0.85
R3 N001 0 {Rsense}
B1 Vdg 0 V=V(Vout)*Nps
B2 0 Vout I=I(B1)*Nps
V3 Vload N002 12
C1 VIPL 0 100n
C2 SFST 0 100p Rser=5m
R1 SFST VIPL 2.49k
I1 0 SFST {ISFST}
D1 SFST N004 DI
V4 N004 0 3.3
C3 N007 0 22n
C4 Vc 0 1n
R2 Vc N007 22k
I2 0 Vc {IVC}
B3 N005 0 V=V(SFST)
D2 Vc N005 DI
D3 N003 Vc DI
V5 N003 0 0.8
B4 Icy 0 V=if(V(Vc)>1.0, (V(Vc)-1)*gVc/rsense, 1u)
R4 isense 0 {Rsense}
B5 0 isense I=V(ipk)
R5 Vcomp isense 400
D4 Vlim Vcomp DI
D5 N003 SFST DI
R6 0 SFST 1Meg
R7 0 Vc 100k
R9 N006 Vcomp 301k
R10 Vin N006 1Meg
V2 N008 0 {Vlimit}
C5 Vcomp 0 10p Rser=10
R8 Vlim_ N008 11.5k
R11 Vlim_ 0 301
B7 Vlim 0 V=V(vlim_)
D6 Vout Vload DI
R12 Vout 0 1Meg
C6 Vout 0 100µ Rser=1
VAC Ic Icy AC 1
R13 N002 0 1m
B8 SFST_computed 0 V=V(Ic,Icy) Laplace={-g0/(s*(s+p0))}
B6 VIPL 0 I=V(Vcomp,Vlim)*V(VIPL)*Lm/(Vin*Tsw*Rpulldown*Rsense)

* block symbol definitions
.subckt cpm_control_irm Ic+ Ic- Vcg+ Vcg- Vdg+ Vdg- Icharge Idischarge Ipeak Ivalley DUTY
B9 N004 0 V=V(alpha)*V(icn) + (1-V(alpha))*V(iv1x) - V(md)*Tsw
B10 iv1x 0 V=delay(V(iv0), Tsw)
B11 mc 0 V=V(Vcg+,Vcgn)/Lm
B12 md 0 V=V(Vdg+,Vdgn)/Lm
B15 acg 0 V=(1/(2*Tsw))*V(mc)
B16 bcg 0 V=-(1/(2*Tsw))*(V(mc) + 2*V(md))
B17 N007 0 V=(V(mc)+V(md))**2
B18 ccg 0 V=(1/(Tsw))*V(md)
B19 dcg 0 V=V(mc)*V(md)
B20 ecg 0 V=V(md)*V(md)
B21 fcg 0 V=(Tsw/2)*V(mc)*V(md)*V(md)
B22 adg 0 V=-(1/(2*Tsw))*(2*V(mc)+V(md))
B23 bdg 0 V=(1/(2*Tsw))*V(md)
B24 cdg 0 V=(1/(Tsw))*V(mc)
B25 ddg 0 V=V(mc)*V(mc)
B26 edg 0 V=V(mc)*V(md)
B27 fdg 0 V=(Tsw/2)*V(mc)*V(mc)*V(md)
BIdg Vdgn Vdg+ I=DSF*((V(adg)*V(iv1)*V(iv1) + V(bdg)*V(iv1)*V(iv1) + V(cdg)*V(iv1)*V(iv1) + V(ddg)*V(iv1) + V(edg)*V(iv1) + V(fdg))/V(den))
BIcg Vcg+ Vcgn I=DSF*((V(acg)*V(iv1)*V(iv1) + V(bcg)*V(iv1)*V(iv1) + V(ccg)*V(iv1)*V(iv1) + V(dcg)*V(iv1) + V(ecg)*V(iv1) + V(fcg))/V(den))
R12 den N007 1
D6 N006 den DI
B28 N006 0 V=2u
C1 den 0 100p
R1 Ic+ Ic- 10Meg
B1 N002 0 V=fsw*(V(icn) - V(iv1))/(V(mc)+mcmp)
R2 D N002 1K
D1 icn N003 DI
D2 N005 icn DI
B3 Icharge 0 V=I(BIcg)
B4 Idischarge 0 V=I(BIdg)
B5 Ipeak 0 V=V(iv1)+V(D)*Tsw*V(mc)
B6 Ivalley 0 V=V(iv1)
B7 DUTY 0 V=V(D)
R3 iv0 N004 1k
B2 alpha 0 V=(V(mc)+V(md))/(V(mc)+mcmp)
B8 N001 0 V=V(Ic+,Ic-)
B13 N005 0 V={DMIN*Tsw*(V(mc)+mcmp)+V(iv1)+1u}
B14 N003 0 V={DMAX*Tsw*(V(mc)+mcmp)+V(iv1)-1u}
D3 Vcg- Vcg+ DI
D4 Vdg- Vdg+ DI
V1 Vdg- Vdgn 100µ
V2 Vcg- Vcgn 100µ
R4 icn N001 1k
B29 iv1 0 V=delay(V(iv0), Tsx)
* iv[n]
* IIR FILTER VALLEY CURRENT TRANSFER FUNCTION
* RELATES VALLEY CURRENTS TO DUTY CYCLE COMMAND SIGNAL
* iv[n-1]
* .param mc {Vcg/Lm}
* .param md {Vdg/Lm}
* .param dencom {(mc*mc + 2*mc*md + md*md)}
* .param acg {(1/(2*Tsw))*((mc)/dencom)}
* .param bcg {-(1/(2*Tsw))*((mc + 2*md)/dencom)}
* .param ccg {(1/(Tsw))*((md)/dencom)}
* .param dcg {(mc*md)/dencom}
* .param ecg {md*md/dencom}
* .param fcg  {(Tsw/2)*mc*md*md/dencom}
* INDUCTOR CURRENT CHARGING SLOPE
* INDUCTOR CURRENT DISCHARGING SLOPE
* CONVENIENT VARIABLE SUBSTITUTION FOR A DENOMINATOR TERM FOUND IN EVERY COEFFICIENT
* COEFFICIENT: acg*iv[n]^2
* COEFFICIENT: bcg*iv[n-1]^2
* COEFFICIENT: ccg*iv[n]*iv[n-1]
* COEFFICIENT: dcg*iv[n]
* COEFFICIENT: ecg*iv[n-1]
* CONSTANT   :  fcg, APPEARS IN STEADY-STATE AVERAGE CURRENT COMPUTATION
* COMPUTED PARAMETERS -- SYSTEM VARIABLES AND COEFFICIENTS
* ;.param mc {Vcg/Lm}
* ;.param md {Vdg/Lm}
* ;.param dencom {(mc*mc + 2*mc*md + md*md)}
* .param adg {-(1/(2*Tsw))*((2*mc + md)/dencom)}
* .param bdg {(1/(2*Tsw))*((md)/dencom)}
* .param cdg {(1/(Tsw))*((mc)/dencom)}
* .param ddg {(mc*mc)/dencom}
* .param edg {mc*md/dencom}
* .param fdg  {(Tsw/2)*md*mc*mc/dencom}
* INDUCTOR CURRENT CHARGING SLOPE
* INDUCTOR CURRENT DISCHARGING SLOPE
* CONVENIENT VARIABLE SUBSTITUTION FOR A DENOMINATOR TERM FOUND IN EVERY COEFFICIENT
* COEFFICIENT: adg*iv[n]^2
* COEFFICIENT: bdg*iv[n-1]^2
* COEFFICIENT: cdg*iv[n]*iv[n-1]
* COEFFICIENT: ddg*iv[n]
* COEFFICIENT: edg*iv[n-1]
* CONSTANT   :  fdg, APPEARS IN STEADY-STATE AVERAGE CURRENT COMPUTATION
* V=V(acg)*V(iv0)*V(iv0) + V(bcg)*V(iv1)*V(iv1) + V(ccg)*V(iv0)*V(iv1) + V(dcg)*V(iv0) + V(ecg)*V(iv1) + V(fcg)
* V=V(adg)*V(iv0)*V(iv0) + V(bdg)*V(iv1)*V(iv1) + V(cdg)*V(iv0)*V(iv1) + V(ddg)*V(iv0) + V(edg)*V(iv1) + V(fdg)
* CHARGE CYCLE NON-LTI FIR RESPONSE COEFFICIENTS
* DISCHARGE CYCLE NON-LTI FIR RESPONSE COEFFICIENTS
* COMPUTED PARAMETERS -- SYSTEM VARIABLES AND COEFFICIENTS
* SCALE FACTOR COMMON TO ALL FIR COEFFICIENTS
* FIR FILTER -- AVERAGE CURRENT TRANSFER FUNCTION
* RELATES AVERAGE CURRENTS TO VALLEY CURRENTS
* <--If "den" was not computed separately
* <--If "den" was not computed separately
* INPUTS AND OUTPUTS
* DISCHARGE CYCLE CURRENT
* CHARGE CYCLE CURRENT
* DUTY CYCLE CONTROL INPUT
.model DI D(Vfwd=1u Ron=1u)
* DUTY LIMIT
* D (DUTY) AND D' (1-DUTY)
* IIR COEFFICIENTS
.param Tsw {1/fsw}
* {DMIN*Tsw*V(mc)+V(iv1)+1u}
* {DMAX*Tsw*V(mc)+V(iv1)-1u}
* I=(V(adg)*V(iv0)*V(iv0) + V(bdg)*V(iv1)*V(iv1) + V(cdg)*V(iv0)*V(iv1) + V(ddg)*V(iv0) + V(edg)*V(iv1) + V(fdg))/V(den)
.param Tsx {Tsw/DS}
.param DS 100
* I=DS*((V(acg)*V(iv0)*V(iv0) + V(bcg)*V(iv1)*V(iv1) + V(ccg)*V(iv0)*V(iv1) + V(dcg)*V(iv0) + V(ecg)*V(iv1) + V(fcg))/V(den))
* iv[n-1]
.param DSF 1
.ends cpm_control_irm

.model D D
.lib standard.dio
* .tran 25m
.param Rsense 6m
.param gVc 0.07
.param ilim {75m/Rsense}
.param Vin 8
.param Lm 35u
.param Nps 2
.param Fsw 65k
.param Tsw {1/Fsw}
.param Vlimit 2.5
.model DI D(Vfwd=1u Ron=1u)
.param Rpulldown 1k
* (Ipk - Ilim) = D*Tsw*Vin/Lm
* tover = D*Tsw = (Ipk-Ilim)*Lm/Vin
* D = (Ipk-Ilim)*Lm/(Vin*Tsw)
* Ipulldown = D*V(SFST)/Rpulldown
.param ISFST 26u
.param IVC 50u
* .step param Fsw list 58k 65k 72k
* .step param Lm list 33u 35u 37u
* .step param Vlimit list 2.37 2.5 2.63
* .IC V(VIPL)={SFST_IC}
* .IC V(SFST)={SFST_IC}
* .IC V(Vc)={SFST_IC}
.param SFST_IC 2
.ac dec 1k 10 65k
* .step param Vin list 8 12 24 48 60
.param Rss 2.49k
.param Csw 100n
.param Css 100p
.param g0 = {1.0/(Rss*Csw*Css)}
.param p0 = {(Csw + Css)/(Rss * Css * Csw)}
* {2.39*Lm/(Vin*Tsw*Rpulldown*Rsense)}
.backanno
.end